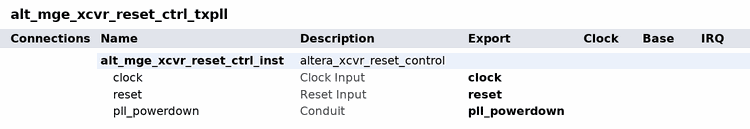
[diagram p0: system contents]
# Platform Designer (Qsys) system alt_mge_xcvr_reset_ctrl_txpll, Arria V Unknown
# Parameters at their usual value, and those the tool derives, are not listed.
package require -exact qsys 14.1
create_system alt_mge_xcvr_reset_ctrl_txpll
set_project_property DEVICE_FAMILY {Arria V}
set_project_property DEVICE Unknown

add_instance alt_mge_xcvr_reset_ctrl_inst altera_xcvr_reset_control 14.1
set_instance_property alt_mge_xcvr_reset_ctrl_inst AUTO_EXPORT true
set_instance_parameter_value alt_mge_xcvr_reset_ctrl_inst CHANNELS 1
set_instance_parameter_value alt_mge_xcvr_reset_ctrl_inst PLLS 2
set_instance_parameter_value alt_mge_xcvr_reset_ctrl_inst RX_ENABLE 0
set_instance_parameter_value alt_mge_xcvr_reset_ctrl_inst RX_PER_CHANNEL 0
set_instance_parameter_value alt_mge_xcvr_reset_ctrl_inst SYNCHRONIZE_PLL_RESET 1
set_instance_parameter_value alt_mge_xcvr_reset_ctrl_inst SYS_CLK_IN_MHZ 125
set_instance_parameter_value alt_mge_xcvr_reset_ctrl_inst TX_ENABLE 0
set_instance_parameter_value alt_mge_xcvr_reset_ctrl_inst TX_PLL_ENABLE 1
set_instance_parameter_value alt_mge_xcvr_reset_ctrl_inst T_RX_ANALOGRESET 40
set_instance_parameter_value alt_mge_xcvr_reset_ctrl_inst T_TX_DIGITALRESET 20
set_instance_parameter_value alt_mge_xcvr_reset_ctrl_inst device_family {Arria V}
set_instance_parameter_value alt_mge_xcvr_reset_ctrl_inst gui_pll_cal_busy 0

# exported interfaces
add_interface clock clock sink
set_interface_property clock EXPORT_OF alt_mge_xcvr_reset_ctrl_inst.clock
add_interface pll_powerdown conduit end
set_interface_property pll_powerdown EXPORT_OF alt_mge_xcvr_reset_ctrl_inst.pll_powerdown
add_interface reset reset sink
set_interface_property reset EXPORT_OF alt_mge_xcvr_reset_ctrl_inst.reset

set_interconnect_requirement {$system} qsys_mm.clockCrossingAdapter HANDSHAKE
set_interconnect_requirement {$system} qsys_mm.insertDefaultSlave FALSE
set_interconnect_requirement {$system} qsys_mm.maxAdditionalLatency 1

save_system alt_mge_xcvr_reset_ctrl_txpll.qsys
